# EAGLE design Expand_v1_01 (EAGLE 6.5.0)
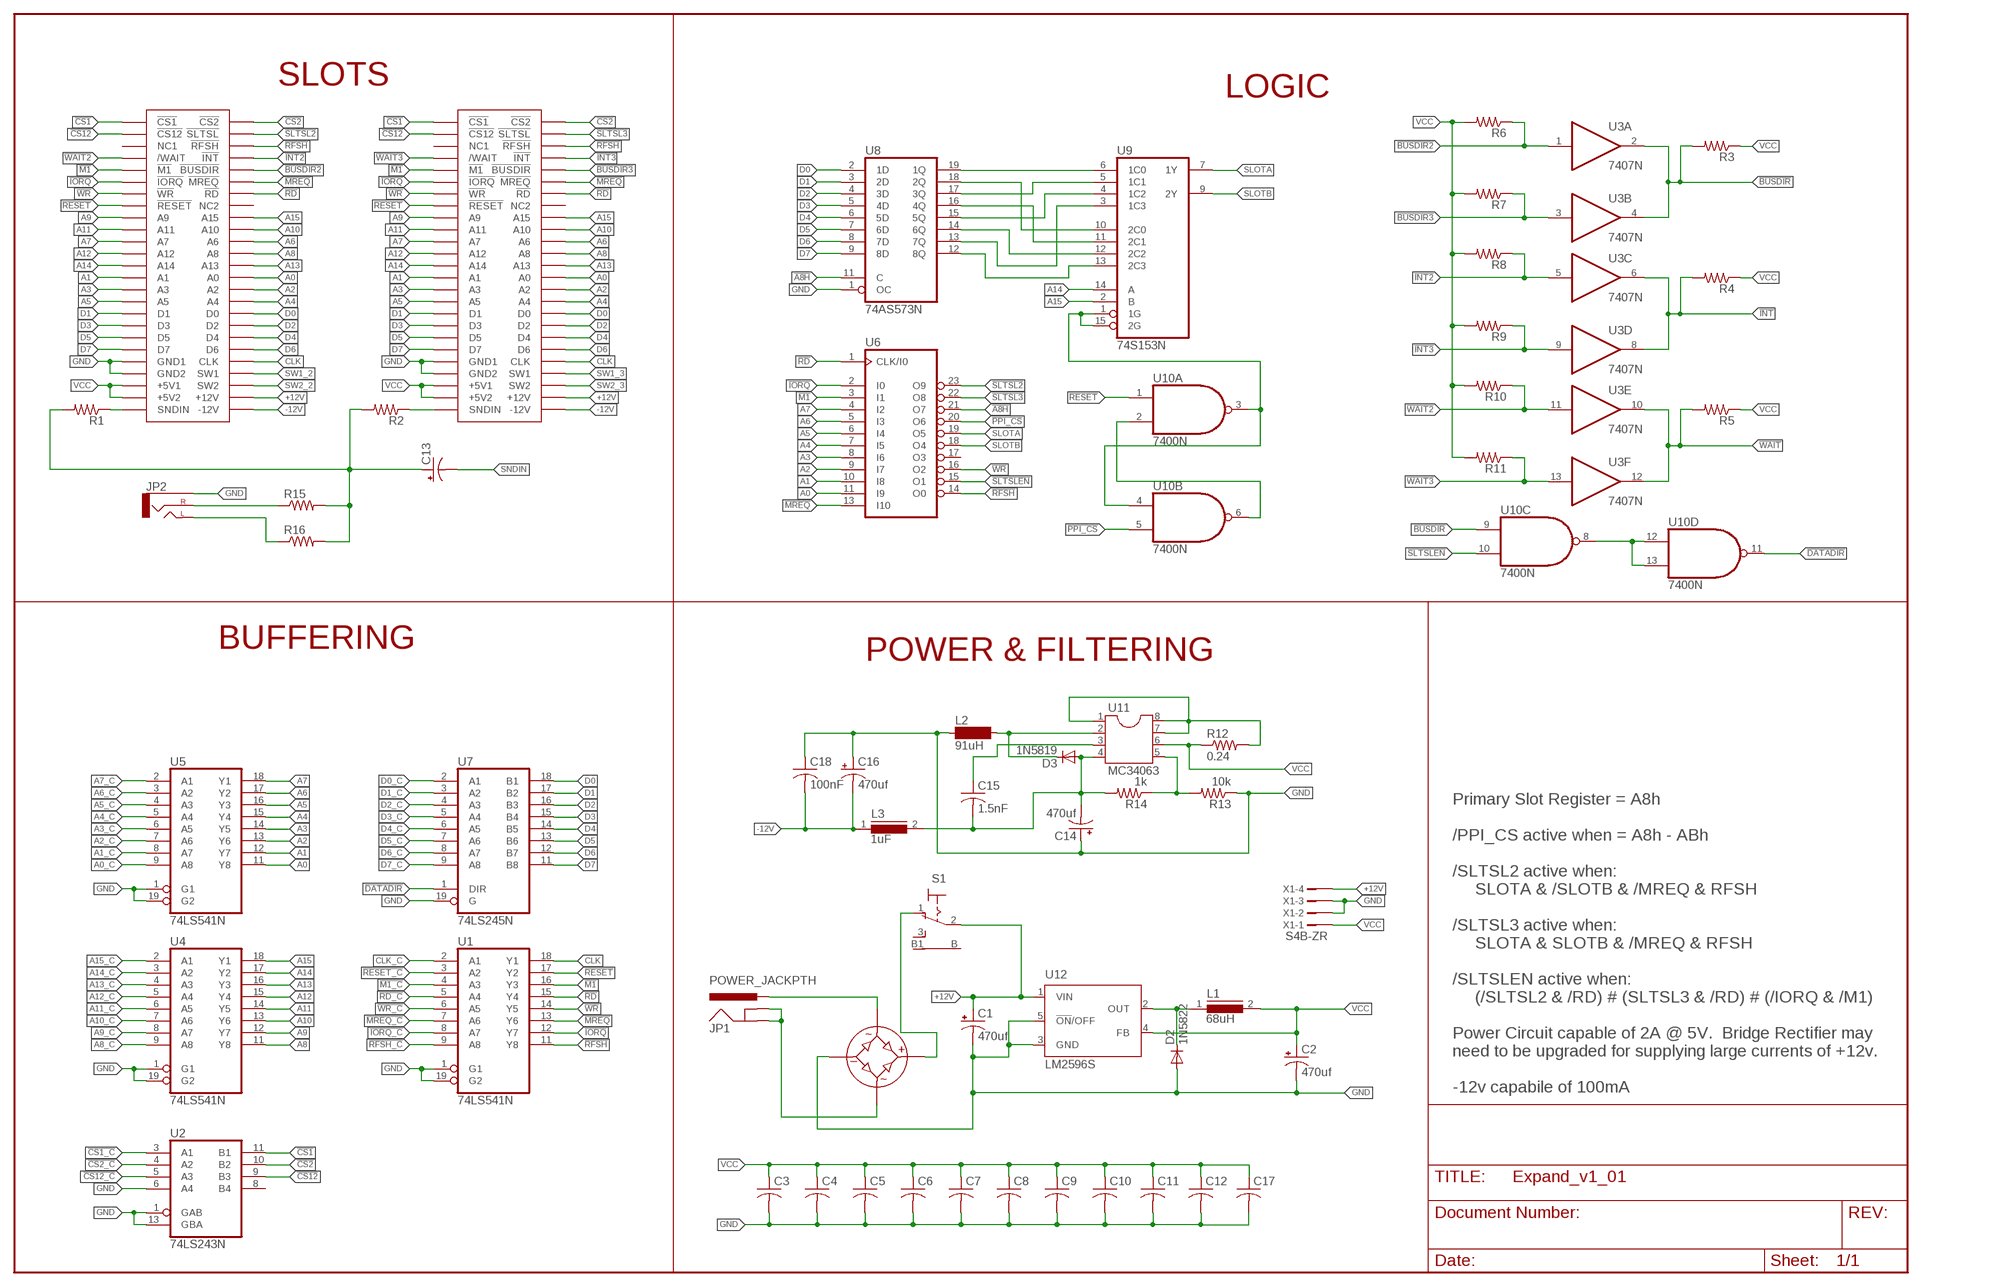
[diagram p0: schematic, sheet 1]

## Parts
C1  470uf  CPOL-USE5-10.5  [E5-10,5]
C2  470uf  CPOL-USE5-10.5  [E5-10,5]
C3  C-US050-030X075  [C050-030X075]
C4  C-US050-030X075  [C050-030X075]
C5  C-US050-030X075  [C050-030X075]
C6  C-US050-030X075  [C050-030X075]
C7  C-US050-030X075  [C050-030X075]
C8  C-US050-030X075  [C050-030X075]
C9  C-US050-030X075  [C050-030X075]
C10  C-US050-030X075  [C050-030X075]
C11  C-US050-030X075  [C050-030X075]
C12  C-US050-030X075  [C050-030X075]
C13  CPOL-USE2-4  [E2-4]
C14  470uf  CPOL-USE5-10.5  [E5-10,5]
C15  1.5nF  C-US050-030X075  [C050-030X075]
C16  470uf  CPOL-USE5-10.5  [E5-10,5]
C17  C-US050-030X075  [C050-030X075]
C18  100nF  C-US050-030X075  [C050-030X075]
D1  2W10  [2W10]
D2  1N5822  1N5624  [DO201-15]
D3  1N5819  DIODE-DO15-12  [DO15-12]
JP1  POWER_JACKPTH  [POWER_JACK_PTH]
JP2  AUDIO-JACK1:1  [STEREOJACK2.5MM]
L1  68uH  A26GFC  [A26GFC]
L2  91uH  BS11  [BS11]
L3  1uF  MCC10  [MCC10]
R1  R-US_0207/7  [0207/7]
R2  R-US_0207/7  [0207/7]
R3  R-US_0207/7  [0207/7]
R4  R-US_0207/7  [0207/7]
R5  R-US_0207/7  [0207/7]
R6  R-US_0207/7  [0207/7]
R7  R-US_0207/7  [0207/7]
R8  R-US_0207/7  [0207/7]
R9  R-US_0207/7  [0207/7]
R10  R-US_0207/7  [0207/7]
R11  R-US_0207/7  [0207/7]
R12  0.24  R-US_0207/7  [0207/7]
R13  10k  R-US_0207/7  [0207/7]
R14  1k  R-US_0207/7  [0207/7]
R15  R-US_0207/7  [0207/7]
R16  R-US_0207/7  [0207/7]
S1  9070-1W  [9070-1W]
U1  74LS541N  [DIL20]
U2  74LS243N  [DIL14]
U3  7407N  [DIL14]
U4  74LS541N  [DIL20]
U5  74LS541N  [DIL20]
U6  22V10  [DIL24-3]
U7  74LS245N  [DIL20]
U8  74AS573N  [DIL20]
U9  74S153N  [DIL16]
U10  7400N  [DIL14]
U11  MC34063  DIL8  [DIL08]
U12  LM2596S  [TO263-5]
U$1  MSX_CART_SLOT  [CART_SLOT]
U$2  MSX_CART_SLOT  [CART_SLOT]
X1  S4B-ZR  [S4B-ZR]

## Nets
!A8H: U6.21(O7) U8.11(C)
!BUSDIR: R3.2 U3.2(A:O) U3.4(B:O) U10.9(C:I0)
!BUSDIR2: R6.1 U3.1(A:I) U$1.P$10(!BUSDIR)
!BUSDIR3: R7.1 U3.3(B:I) U$2.P$10(!BUSDIR)
!CS1: U2.11(B1) U$1.P$1(!CS1) U$2.P$1(!CS1)
!CS1_C: U2.3(A1)
!CS2: U2.10(B2) U$1.P$2(!CS2) U$2.P$2(!CS2)
!CS2_C: U2.4(A2)
!CS12: U2.9(B3) U$1.P$3(!CS12) U$2.P$3(!CS12)
!CS12_C: U2.5(A3)
!DATADIR: U7.1(DIR) U10.11(D:O)
!INT: R4.2 U3.6(C:O) U3.8(D:O)
!INT2: R8.1 U3.5(C:I) U$1.P$8(!INT)
!INT3: R9.1 U3.9(D:I) U$2.P$8(!INT)
!IORQ: U1.12(Y7) U6.2(I0) U$1.P$11(!IORQ) U$2.P$11(!IORQ)
!IORQ_C: U1.8(A7)
!M1: U1.16(Y3) U6.3(I1) U$1.P$9(!M1) U$2.P$9(!M1)
!M1_C: U1.4(A3)
!MREQ: U1.13(Y6) U6.13(I10) U$1.P$12(!MREQ) U$2.P$12(!MREQ)
!MREQ_C: U1.7(A6)
!PPI_CS: U6.20(O6) U10.5(B:I1)
!RD: U1.15(Y4) U6.1(CLK/I0) U$1.P$14(!RD) U$2.P$14(!RD)
!RD_C: U1.5(A4)
!RESET: U1.17(Y2) U10.1(A:I0) U$1.P$15(!RESET) U$2.P$15(!RESET)
!RESET_C: U1.3(A2)
!RFSH: U1.11(Y8) U6.14(O0) U$1.P$6(!RFSH) U$2.P$6(!RFSH)
!RFSH_C: U1.9(A8)
!SLTSL2: U6.23(O9) U$1.P$4(!SLTSL)
!SLTSL3: U6.22(O8) U$2.P$4(!SLTSL)
!SLTSLEN: U6.15(O1) U10.10(C:I1)
!WAIT: R5.2 U3.10(E:O) U3.12(F:O)
!WAIT2: R10.1 U3.11(E:I) U$1.P$7(/WAIT)
!WAIT3: R11.1 U3.13(F:I) U$2.P$7(/WAIT)
!WR: U1.14(Y5) U6.16(O2) U$1.P$13(!WR) U$2.P$13(!WR)
!WR_C: U1.6(A5)
+12V: C1.+ S1.2(P) U12.1(VIN) U$1.P$48(+12V) U$2.P$48(+12V) X1.4
-12V: C16.- C18.2 L3.1 U$1.P$50(-12V) U$2.P$50(-12V)
A0: U5.11(Y8) U6.11(I9) U$1.P$28(A0) U$2.P$28(A0)
A0_C: U5.9(A8)
A1: U5.12(Y7) U6.10(I8) U$1.P$27(A1) U$2.P$27(A1)
A1_C: U5.8(A7)
A2: U5.13(Y6) U6.9(I7) U$1.P$30(A2) U$2.P$30(A2)
A2_C: U5.7(A6)
A3: U5.14(Y5) U6.8(I6) U$1.P$29(A3) U$2.P$29(A3)
A3_C: U5.6(A5)
A4: U5.15(Y4) U6.7(I5) U$1.P$32(A4) U$2.P$32(A4)
A4_C: U5.5(A4)
A5: U5.16(Y3) U6.6(I4) U$1.P$31(A5) U$2.P$31(A5)
A5_C: U5.4(A3)
A6: U5.17(Y2) U6.5(I3) U$1.P$22(A6) U$2.P$22(A6)
A6_C: U5.3(A2)
A7: U5.18(Y1) U6.4(I2) U$1.P$21(A7) U$2.P$21(A7)
A7_C: U5.2(A1)
A8: U4.11(Y8) U$1.P$24(A8) U$2.P$24(A8)
A8_C: U4.9(A8)
A9: U4.12(Y7) U$1.P$17(A9) U$2.P$17(A9)
A9_C: U4.8(A7)
A10: U4.13(Y6) U$1.P$20(A10) U$2.P$20(A10)
A10_C: U4.7(A6)
A11: U4.14(Y5) U$1.P$19(A11) U$2.P$19(A11)
A11_C: U4.6(A5)
A12: U4.15(Y4) U$1.P$23(A12) U$2.P$23(A12)
A12_C: U4.5(A4)
A13: U4.16(Y3) U$1.P$26(A13) U$2.P$26(A13)
A13_C: U4.4(A3)
A14: U4.17(Y2) U9.14(A) U$1.P$25(A14) U$2.P$25(A14)
A14_C: U4.3(A2)
A15: U4.18(Y1) U9.2(B) U$1.P$18(A15) U$2.P$18(A15)
A15_C: U4.2(A1)
CLK: U1.18(Y1) U$1.P$42(CLK) U$2.P$42(CLK)
CLK_C: U1.2(A1)
D0: U7.18(B1) U8.2(1D) U$1.P$34(D0) U$2.P$34(D0)
D0_C: U7.2(A1)
D1: U7.17(B2) U8.3(2D) U$1.P$33(D1) U$2.P$33(D1)
D1_C: U7.3(A2)
D2: U7.16(B3) U8.4(3D) U$1.P$36(D2) U$2.P$36(D2)
D2_C: U7.4(A3)
D3: U7.15(B4) U8.5(4D) U$1.P$35(D3) U$2.P$35(D3)
D3_C: U7.5(A4)
D4: U7.14(B5) U8.6(5D) U$1.P$38(D4) U$2.P$38(D4)
D4_C: U7.6(A5)
D5: U7.13(B6) U8.7(6D) U$1.P$37(D5) U$2.P$37(D5)
D5_C: U7.7(A6)
D6: U7.12(B7) U8.8(7D) U$1.P$40(D6) U$2.P$40(D6)
D6_C: U7.8(A7)
D7: U7.11(B8) U8.9(8D) U$1.P$39(D7) U$2.P$39(D7)
D7_C: U7.9(A8)
GND: C1.- C2.- C3.2 C4.2 C5.2 C6.2 C7.2 C8.2 C9.2 C10.2 C11.2 C12.2 C14.+ C16.+ C17.2 C18.1 D1.P$4 D2.A JP2.5(SLEEVE) L2.1 R13.1 U1.1(G1) U1.19(G2) U2.1(GAB) U2.6(A4) U2.13(GBA) U4.1(G1) U4.19(G2) U5.1(G1) U5.19(G2) U7.19(G) U8.1(OC) U12.3(GND) U12.5(!ON!/OFF) U$1.P$41(GND1) U$1.P$43(GND2) U$2.P$41(GND1) U$2.P$43(GND2) X1.2 X1.3
N$1: R2.1 U$2.P$49(SNDIN)
N$2: R1.1 U$1.P$49(SNDIN)
N$3: U8.19(1Q) U9.6(1C0)
N$4: C13.+ R1.2 R2.2 R15.2 R16.2
N$5: U8.18(2Q) U9.10(2C0)
N$6: U8.17(3Q) U9.5(1C1)
N$7: U8.16(4Q) U9.11(2C1)
N$8: U8.15(5Q) U9.4(1C2)
N$9: U8.14(6Q) U9.12(2C2)
N$10: U8.13(7Q) U9.3(1C3)
N$11: U8.12(8Q) U9.13(2C3)
N$12: U10.2(A:I1) U10.6(B:O)
N$13: U9.1(1G) U9.15(2G) U10.3(A:O) U10.4(B:I0)
N$14: U10.8(C:O) U10.12(D:I0) U10.13(D:I1)
N$18: D1.P$2 S1.1(O)
N$20: R12.2 U11.1 U11.7 U11.8
N$21: JP2.4(RIGHT) R15.1
N$22: R13.2 R14.1 U11.5
N$23: D1.P$1 JP1.PWR
N$24: D1.P$3 JP1.GND JP1.GNDBREAK
N$25: C14.- C15.2 D3.A L3.2 R14.2 U11.4
N$26: C15.1 U11.3
N$27: D3.C L2.2 U11.2
N$28: JP2.1(LEFT) R16.1
N$29: D2.C L1.1 U12.2(OUT)
SLOTA: U6.19(O5) U9.7(1Y)
SLOTB: U6.18(O4) U9.9(2Y)
SNDIN: C13.-
SW1_2: U$1.P$44(SW1)
SW1_3: U$2.P$44(SW1)
SW2_2: U$1.P$46(SW2)
SW2_3: U$2.P$46(SW2)
VCC: C2.+ C3.1 C4.1 C5.1 C6.1 C7.1 C8.1 C9.1 C10.1 C11.1 C12.1 C17.1 L1.2 R3.1 R4.1 R5.1 R6.2 R7.2 R8.2 R9.2 R10.2 R11.2 R12.1 U11.6 U12.4(FB) U$1.P$45(+5V1) U$1.P$47(+5V2) U$2.P$45(+5V1) U$2.P$47(+5V2) X1.1
Unconnected: S1.3(S) S1.B S1.B1 U2.8(B4) U6.17(O3) U$1.P$5(NC1) U$1.P$16(NC2) U$2.P$5(NC1) U$2.P$16(NC2)

## Notes on the sheet
- SLOTS
- LOGIC
- BUFFERING
- POWER & FILTERING
- Primary Slot Register = A8h
  
  /PPI_CS active when = A8h - ABh
  
  /SLTSL2 active when:
       SLOTA & /SLOTB & /MREQ & RFSH
  
  /SLTSL3 active when:
       SLOTA & SLOTB & /MREQ & RFSH
  
  /SLTSLEN active when:
       (/SLTSL2 & /RD) # (SLTSL3 & /RD) # (/IORQ & /M1)
  
  Power Circuit capable of 2A @ 5V.  Bridge Rectifier may
  need to be upgraded for supplying large currents of +12v.
  
  -12v capabile of 100mA

## Power pins joined to a net without a drawn wire
GND: U1.10(GND) U2.7(GND) U3.7(P:GND) U4.10(GND) U5.10(GND) U6.12(GND) U7.10(GND) U8.10(GND) U9.8(GND) U10.7(P:GND)
VCC: U1.20(VCC) U2.14(VCC) U3.14(P:VCC) U4.20(VCC) U5.20(VCC) U6.24(VCC) U7.20(VCC) U8.20(VCC) U9.16(VCC) U10.14(P:VCC)

## Library data of the parts
C1 C2 C13 C14 C16 = rcl:CPOL-US: POLARIZED CAPACITOR, American symbol
C3-C12 C15 C17 C18 = rcl:C-US: CAPACITOR, American symbol
D1 = My_Parts:2W10
D2 = diode:1N5624: DIODE controlled avalanche rectifier
D3 = diode:DIODE-: DIODE
JP1 = SparkFun-Connectors:POWER_JACK: Power Jack This is the standard 5.5mm barrel jack for power. The PTH is the most common, proven, reliable, footprint. The Slot footprint only works if the mill layer is transmitted to the PCB fab house so be warned. Mating wall wart : TOL-00298 (and others); PROD_ID: CONN-08197
JP2 = SparkFun-Connectors:AUDIO-JACK: 3.5mm Audio Jack Simple 3.5mm common PCB mount audio jack. Variant PTH is our storefront SKU PRT-08032
L1 = inductors:A26GFC: INDUCTOR
L2 = inductor-neosid:BS: INDUCTOR nominal inductance, magnetically screened; OC_FARNELL: unknown; OC_NEWARK: unknown
L3 = inductors:MCC10: INDUCTOR
R1-R16 = rcl:R-US_: RESISTOR, American symbol
S1 = switch:9070-1W: TOGGLE SWITCH Marquardt
U1 U4 U5 = 74xx-us:74*541: Octal BUFFER and LINE DRIVER, 3-state
U2 = 74xx-us:74*243: Quadruple BUS TRANSCEIVER
U3 = 74xx-us:74*07: Hex BUFFER, open collector high-voltage output
U6 = pal:22V10: PAL; MPN: GAL22V10D-7LPN; OC_FARNELL: 1571925; OC_NEWARK: 97M0480
U7 = 74xx-us:74*245: Octal BUS TRANSCEIVER, 3-state
U8 = 74xx-us:74*573: 8-bit D latch BUS DRIVER
U9 = 74xx-us:74*153: Dual 4-line to 1-line data SELECTOR/MULTIPLEXER
U10 = 74xx-us:74*00: Quad 2-input NAND gate
U11 = ic-package:DIL8: Dual In Line / Socket
U12 = national-semiconductor:LM2596: SIMPLE SWITCHER® Power Converter 150 kHz 3A Step-Down Voltage Regulator Source: http://www.national.com/ds/LM/LM2596.pdf; MF: NATIONAL SEMICONDUCTOR; MPN: LM2596S-ADJ/NOPB; OC_FARNELL: 9494367; OC_NEWARK: 41K3842
U$1 U$2 = msx-con:MSX_CART_SLOT
X1 = con-jst:?4B-ZR: ZH CONNECTOR 1.5 mm, 4 pin 1 row Source: http://www.jst.com .. eZH.pdf; MF: FARNELL; MPN: S4B-ZR(LF)(SN); OC_FARNELL: 9491830; OC_NEWARK: 38K8076

## Board
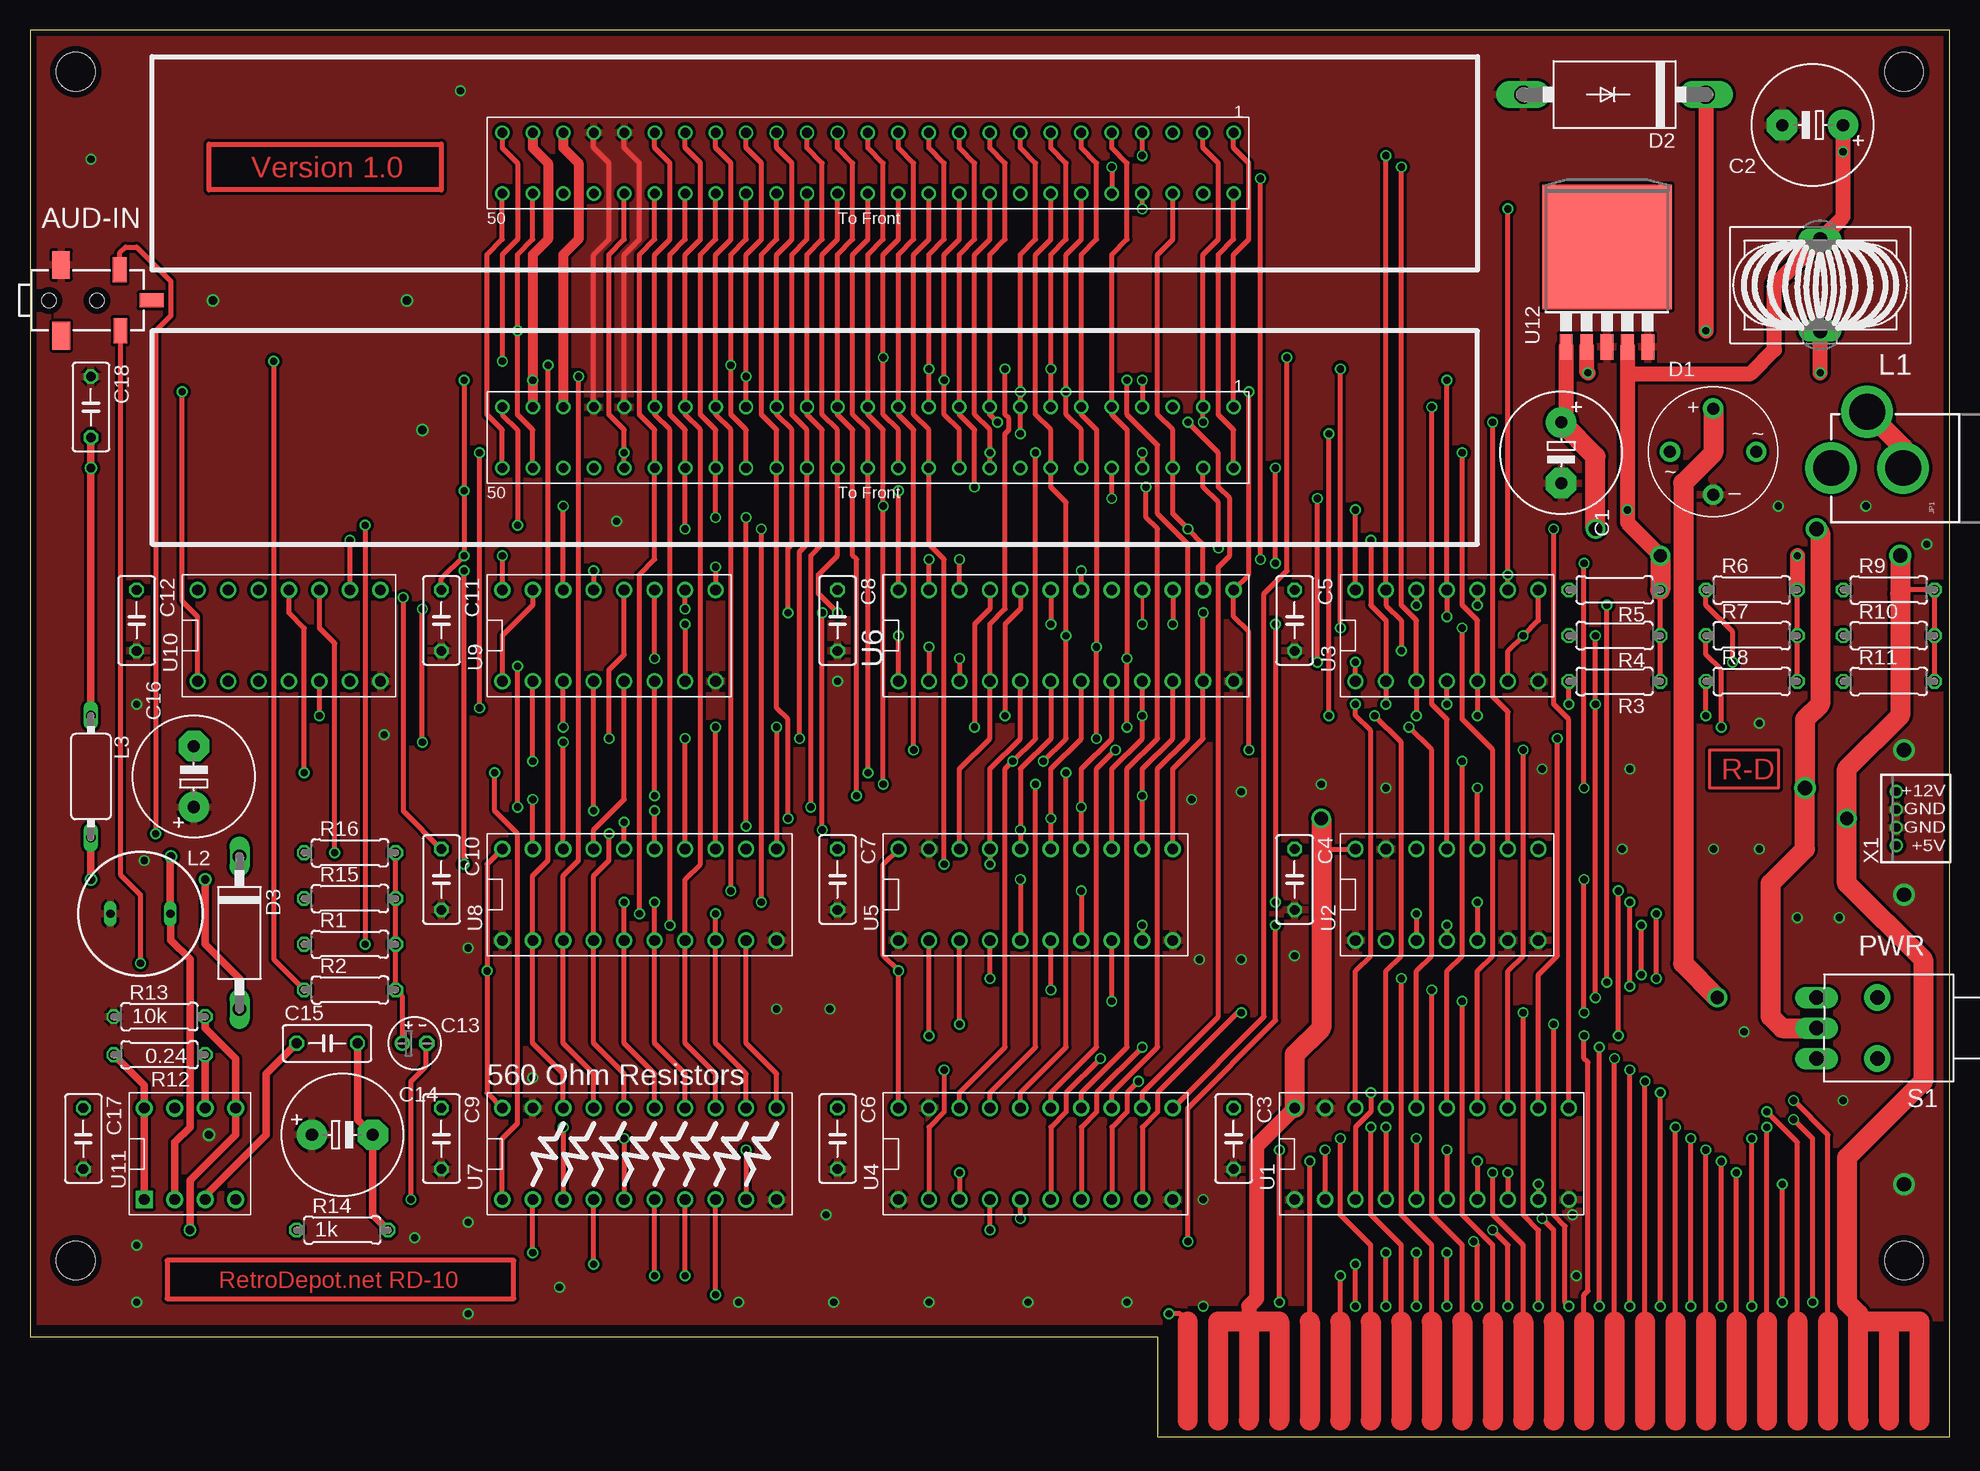
[diagram p1: board, top side]
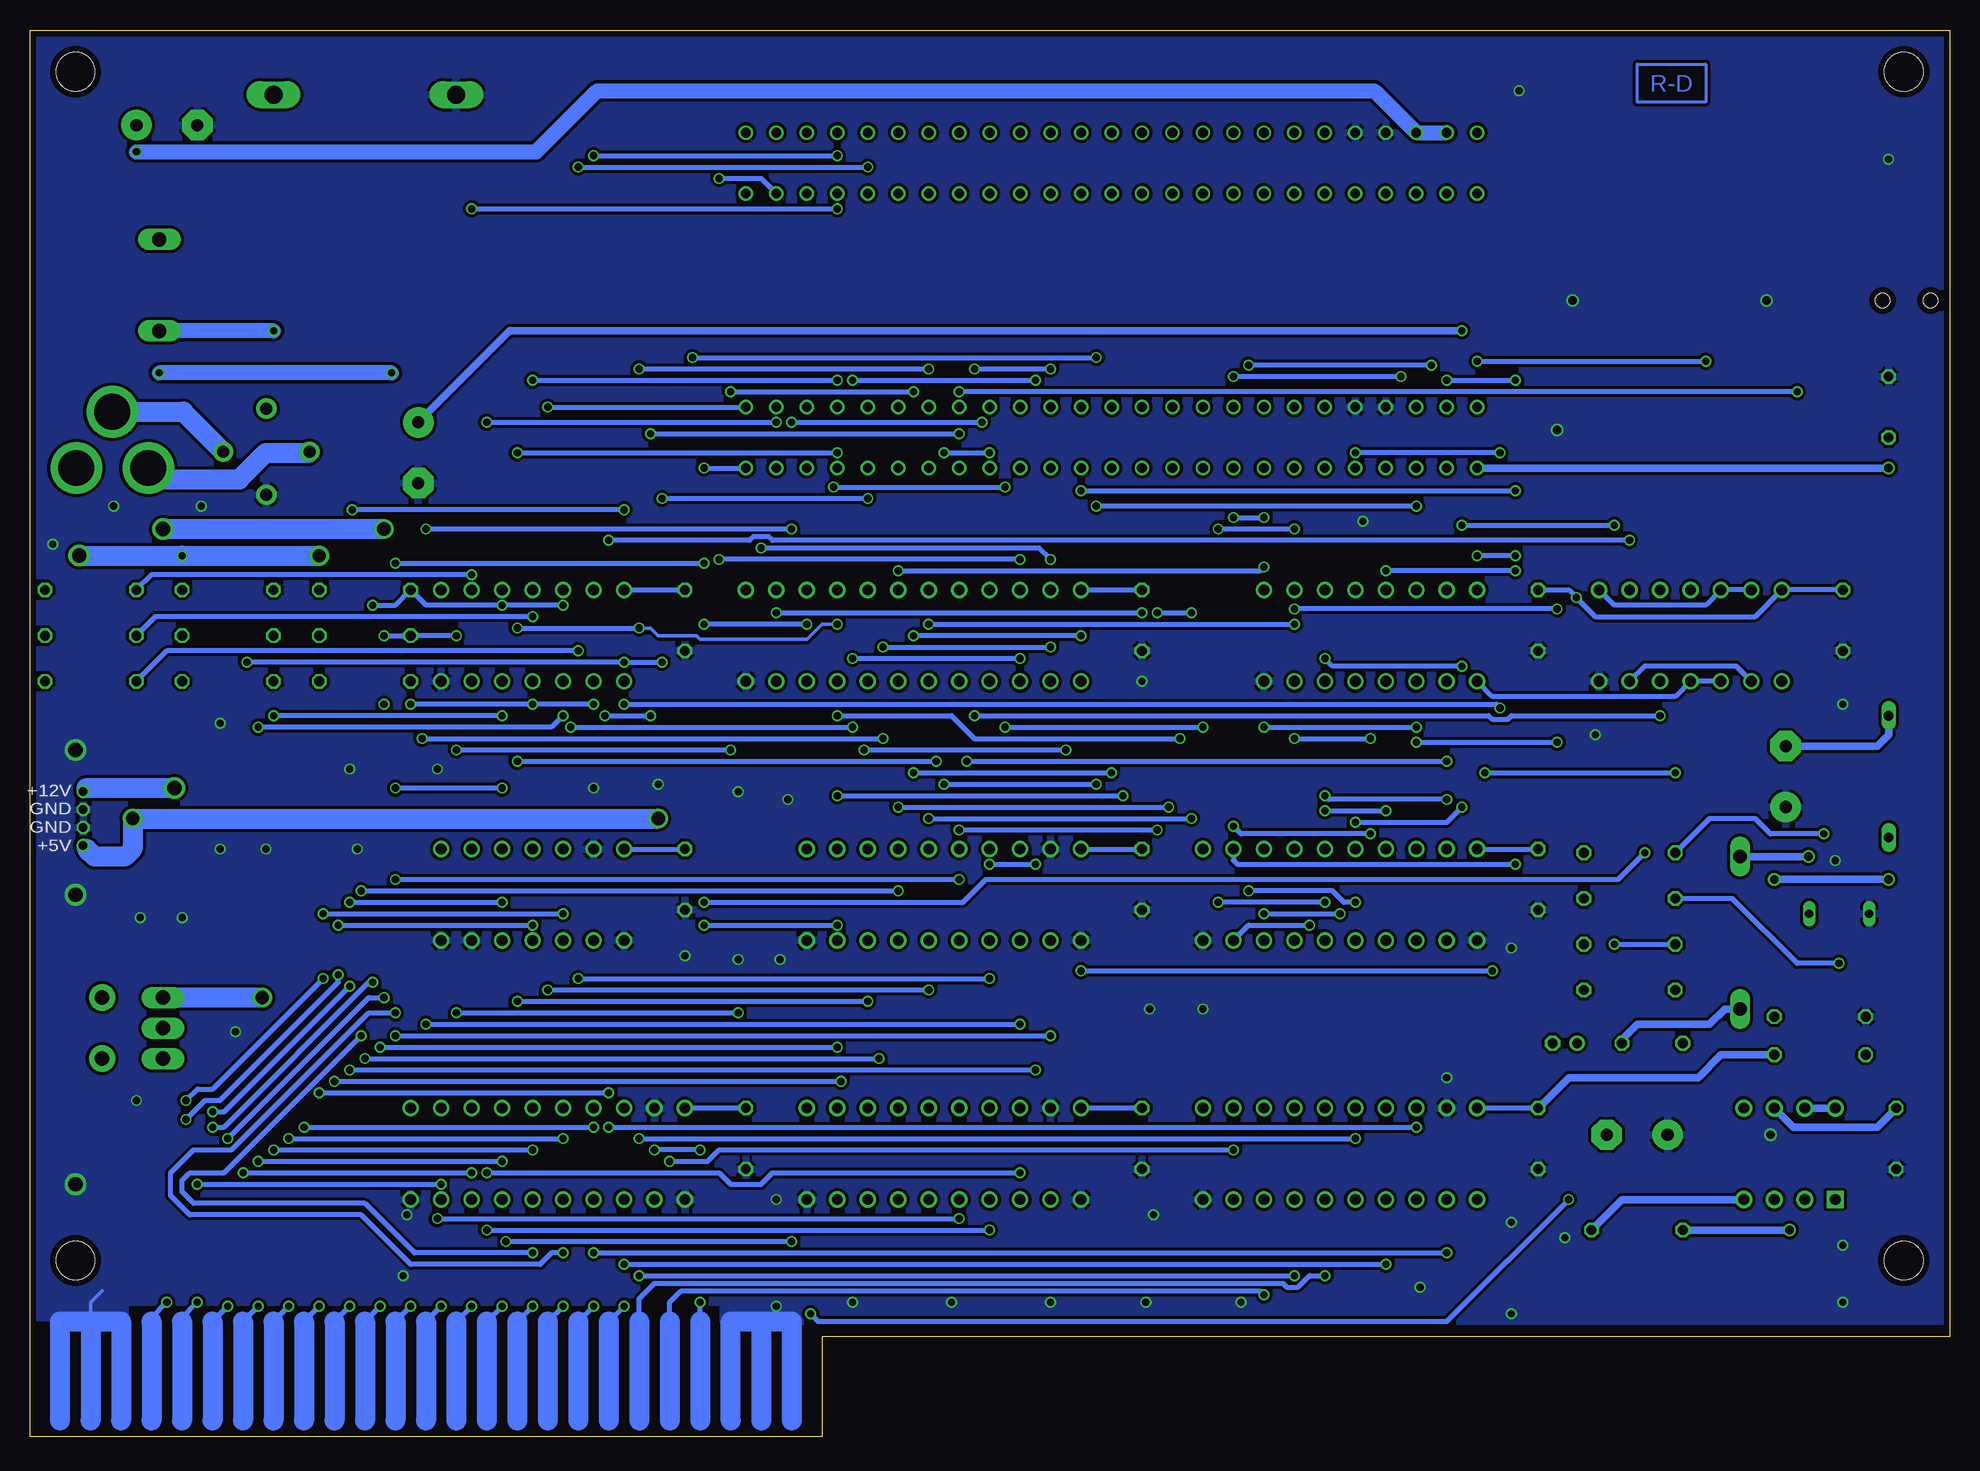
[diagram p2: board, bottom side, seen from below]

Size 160 x 117.24 mm. Coordinates in mm from the lower left corner, seen from the top.
Outline: 0,8.36 93.98,8.36 93.98,0 160,0 160,117.24 0,117.24 0,8.36
Copper layers (1*16): Top 0.035mm / dielectric 1.6mm / Bottom 0.035mm
Design rules "JLCPCB-2-layer-rule": minimum track width 5mil, minimum drill 0.2mm, track to track 5mil, track to pad 5mil, pad to pad 5mil, via to via 5mil, smd to smd 0mil, copper to edge 20mil, drill to drill 0.00508125mm, minimum pad ring 6mil, minimum via ring 6mil, stop-mask expansion 0mil, vias tented up to drill 0.002540625mm, thermal gap 10mil
Holes 3.2 mm at 156.21,113.77 3.81,113.77 3.81,14.7 156.21,14.7

### Footprints (pad centres in the part's own frame; a part is rotated, then mirrored left to right if it is on the bottom)
E5-10,5 = drill 1.016 pad 2.54: + -2.54,0 | drill 1.016 pad 2.54 octagon: - 2.54,0
C050-030X075 = drill 0.813 octagon: 1 -2.54,0; 2 2.54,0
E2-4 = drill 0.813 pad 1.27: + -1.016,0 | drill 0.813 pad 1.27 octagon: - 1.016,0
2W10 = drill 1 pad 1.676: P$1 -3.631,0.093; P$2 -0.039,3.685; P$3 3.554,0.093; P$4 -0.039,-3.499
DO201-15 = drill 1.499 long: A 7.62,0; C -7.62,0
DO15-12 = drill 1.118 long: A 6.35,0; C -6.35,0
POWER_JACK_PTH = drill 2.997 pad 4.318: GND 0,7.7; GNDBREAK 4.7,10.7; PWR 0,13.7
STEREOJACK2.5MM = smd 1.144 x 2.1: 1 5.898,2.54 | smd 1.998 x 1.17: 3 8.55,0 | smd 1.119 x 2.1: 4 5.949,-2.54 | smd 1.467 x 2.3: 5 1,2.952; A 1.016,-2.952 | hole 1.2: 0,0; 4,0
A26GFC = drill 1.194 long: 1 0,3.81; 2 0,-3.81
BS11 = drill 0.7 long: 1 -2.5,0; 2 2.5,0
MCC10 = drill 0.813 long: 1 -5.08,0; 2 5.08,0
0207/7 = drill 0.813 octagon: 1 -3.81,0; 2 3.81,0
9070-1W = drill 1.2 long: 1 5.08,-2.54; 2 5.08,0; 3 5.08,2.54 | drill 1.2 pad 2.184: B 0,-2.54; B1 0,2.54
DIL20 = drill 0.9: 1 -11.43,-3.81; 2 -8.89,-3.81; 3 -6.35,-3.81; 4 -3.81,-3.81; 5 -1.27,-3.81; 6 1.27,-3.81; 7 3.81,-3.81; 8 6.35,-3.81; 9 8.89,-3.81; 10 11.43,-3.81; 11 11.43,3.81; 12 8.89,3.81; 13 6.35,3.81; 14 3.81,3.81; 15 1.27,3.81; 16 -1.27,3.81; 17 -3.81,3.81; 18 -6.35,3.81; 19 -8.89,3.81; 20 -11.43,3.81
DIL14 = drill 0.9: 1 -7.62,-3.81; 2 -5.08,-3.81; 3 -2.54,-3.81; 4 0,-3.81; 5 2.54,-3.81; 6 5.08,-3.81; 7 7.62,-3.81; 8 7.62,3.81; 9 5.08,3.81; 10 2.54,3.81; 11 0,3.81; 12 -2.54,3.81; 13 -5.08,3.81; 14 -7.62,3.81
DIL24-3 = drill 0.9: 1 -13.97,-3.81; 2 -11.43,-3.81; 3 -8.89,-3.81; 4 -6.35,-3.81; 5 -3.81,-3.81; 6 -1.27,-3.81; 7 1.27,-3.81; 8 3.81,-3.81; 9 6.35,-3.81; 10 8.89,-3.81; 11 11.43,-3.81; 12 13.97,-3.81; 13 13.97,3.81; 14 11.43,3.81; 15 8.89,3.81; 16 6.35,3.81; 17 3.81,3.81; 18 1.27,3.81; 19 -1.27,3.81; 20 -3.81,3.81; 21 -6.35,3.81; 22 -8.89,3.81; 23 -11.43,3.81; 24 -13.97,3.81
DIL16 = drill 0.9: 1 -8.89,-3.81; 2 -6.35,-3.81; 3 -3.81,-3.81; 4 -1.27,-3.81; 5 1.27,-3.81; 6 3.81,-3.81; 7 6.35,-3.81; 8 8.89,-3.81; 9 8.89,3.81; 10 6.35,3.81; 11 3.81,3.81; 12 1.27,3.81; 13 -1.27,3.81; 14 -3.81,3.81; 15 -6.35,3.81; 16 -8.89,3.81
DIL08 = drill 0.9 pad 1.422 square: 1 -3.81,-3.81 | drill 0.9 pad 1.422: 2 -1.27,-3.81; 3 1.27,-3.81; 4 3.81,-3.81; 5 3.81,3.81; 6 1.27,3.81; 7 -1.27,3.81; 8 -3.81,3.81
TO263-5 = smd 1.067 x 2.159: 1 -3.404,-5.791; 2 -1.702,-5.791; 3 0,-5.791; 4 1.702,-5.791; 5 3.404,-5.791 | smd 10.8 x 10.41: 6 0,2.54
CART_SLOT = drill 0.8: P$1 30.48,2.54; P$2 30.48,-2.54; P$3 27.94,2.54; P$4 27.94,-2.54; P$5 25.4,2.54; P$6 25.4,-2.54; P$7 22.86,2.54; P$8 22.86,-2.54; P$9 20.32,2.54; P$10 20.32,-2.54; P$11 17.78,2.54; P$12 17.78,-2.54; P$13 15.24,2.54; P$14 15.24,-2.54; P$15 12.7,2.54; P$16 12.7,-2.54; P$17 10.16,2.54; P$18 10.16,-2.54; P$19 7.62,2.54; P$20 7.62,-2.54; P$21 5.08,2.54; P$22 5.08,-2.54; P$23 2.54,2.54; P$24 2.54,-2.54; P$25 0,2.54; P$26 0,-2.54; P$27 -2.54,2.54; P$28 -2.54,-2.54; P$29 -5.08,2.54; P$30 -5.08,-2.54; P$31 -7.62,2.54; P$32 -7.62,-2.54; P$33 -10.16,2.54; P$34 -10.16,-2.54; P$35 -12.7,2.54; P$36 -12.7,-2.54; P$37 -15.24,2.54; P$38 -15.24,-2.54; P$39 -17.78,2.54; P$40 -17.78,-2.54; P$41 -20.32,2.54; P$42 -20.32,-2.54; P$43 -22.86,2.54; P$44 -22.86,-2.54; P$45 -25.4,2.54; P$46 -25.4,-2.54; P$47 -27.94,2.54; P$48 -27.94,-2.54; P$49 -30.48,2.54; P$50 -30.48,-2.54
S4B-ZR = drill 0.7 pad 1.1: 1 -2.25,0; 2 -0.75,0; 3 0.75,0; 4 2.25,0

### Placement (x,y rotation side)
C1  127.64,82.02 270 top
C2  148.59,109.32 180 top
C3  100.33,24.86 270 top
C4  105.41,46.46 270 top
C5  105.41,68.05 270 top
C6  67.31,24.86 270 top
C7  67.31,46.46 270 top
C8  67.31,68.05 270 top
C9  34.29,24.86 270 top
C10  34.29,46.46 270 top
C11  34.29,68.05 270 top
C12  8.89,68.05 270 top
C13  32.07,32.8 0 top
C14  26.04,25.18 0 top
C15  24.77,32.8 0 top
C16  13.65,55.03 90 top
C17  4.45,24.86 270 top
C18  5.08,85.82 270 top
D1  140.34,82.02 0 top
D2  132.08,111.86 180 top
D3  17.46,42.01 270 top
JP1  163.83,80.74 90 top
JP2  1.59,94.71 0 top
L1  149.22,95.98 180 top
L2  9.21,43.6 0 top
L3  5.08,55.03 270 top
R1  26.67,41.06 0 top
R2  26.67,37.25 0 top
R3  132.08,62.97 180 top
R4  132.08,66.77 180 top
R5  132.08,70.58 180 top
R6  143.51,70.58 0 top
R7  143.51,66.77 0 top
R8  143.51,62.97 0 top
R9  154.94,70.58 0 top
R10  154.94,66.77 0 top
R11  154.94,62.97 0 top
R12  10.79,31.85 180 top
R13  10.79,35.03 0 top
R14  26.04,17.25 0 top
R15  26.67,44.87 0 top
R16  26.67,48.68 0 top
S1  153.99,34.07 180 top
U1  116.84,23.59 0 top
U2  118.11,45.19 0 top
U3  118.11,66.77 0 top
U4  83.82,23.59 0 top
U5  83.82,45.19 0 top
U6  86.36,66.77 0 top
U7  50.8,23.59 0 top
U8  50.8,45.19 0 top
U9  48.26,66.77 0 top
U10  21.59,66.77 0 top
U11  13.34,23.59 0 top
U12  131.44,96.62 0 top
U$1  69.85,83.28 0 top
U$2  69.85,106.14 0 top
X1  155.57,51.54 90 top

### Tracks (layer width: path | path; a pad name or v marks a point on that pad's centre or on a via)
!A8H  (via drill 0.6)
  Top 0.406: U6.21 80.01,69 78.74,67.73 v78.74,59.16 | v62.23,59.16 U8.11
  Bottom 0.406: v78.74,59.16 v62.23,59.16
!BUSDIR  (via drill 0.6)
  Top 0.406: U10.9 v26.67,74.71 | v111.76,74.71 111.76,69.31 113.03,68.05 U3.2 v113.03,61.06 | v128.27,61.06 R3.2 | v118.11,61.06 U3.4
  Bottom 0.406: v113.03,61.06 v118.11,61.06 v128.27,61.06 | v26.67,74.71 98.11,74.71 98.42,75.03 99.69,75.03 100.01,74.71 v111.76,74.71
!BUSDIR2  (via drill 0.6)
  Top 0.406: U3.1 v110.49,64.55 | R6.1 139.7,69.31 141.92,67.09 v141.92,64.55 | v107.31,64.55 v107.31,78.2 | v90.17,78.2 U$1.P$10
  Bottom 0.406: v141.92,64.55 v110.49,64.55 v107.31,64.55 | v107.31,78.2 v90.17,78.2
!BUSDIR3  (via drill 0.6)
  Top 0.406: v114.3,105.83 114.3,69.31 115.57,68.05 U3.3 v115.57,60.11 | v90.17,105.83 U$2.P$10 | v140.97,59.16 140.97,63.92 139.7,65.19 R7.1
  Bottom 0.406: v114.3,105.83 v90.17,105.83 | v115.57,60.11 116.52,59.16 v140.97,59.16
!CS1  (via drill 0.6)
  Top 0.406: U$1.P$1 100.33,98.52 101.6,99.8 101.6,106.14 100.33,107.41 U$2.P$1 | U2.11 118.11,59.79 116.84,61.06 v116.84,85.82
  Bottom 0.406: v116.84,85.82 U$1.P$1
!CS1_C  (via drill 0.6)
  Top 0.406: v115.57,43.6 U2.3 | 149.86,9.62 149.86,25.18 v147,28.04 | v135.57,38.2 v135.57,43.6
  Top 1.676: 149.86,9.62 149.86,1.37
  Bottom 0.406: v135.57,43.6 v115.57,43.6 | v147,28.04 146.05,28.99 144.78,28.99 v135.57,38.2
!CS2  (via drill 0.6)
  Top 0.406: U$2.P$2 100.33,99.8 99.06,98.52 99.06,85.19 100.33,83.92 U$1.P$2 | U2.10 v120.65,54.08 | v129.54,54.08 v129.54,72.81 | v103.82,72.81 v103.82,80.74
  Bottom 0.406: v120.65,54.08 v129.54,54.08 | v129.54,72.81 v103.82,72.81 | v103.82,80.74 U$1.P$2
!CS2_C  (via drill 0.6)
  Top 0.406: v118.11,42.65 U2.4 | v148.59,11.21 148.59,24.86 v147,26.45 | v134.3,38.52 v134.3,42.65
  Bottom 0.406: 149.86,9.62 149.86,9.94 v148.59,11.21 | v134.3,42.65 v118.11,42.65 | v147,26.45 145.41,28.04 144.15,28.04 134.3,37.88 v134.3,38.52
  Bottom 1.676: 149.86,9.62 149.86,1.37
!CS12  (via drill 0.6)
  Top 0.406: U$2.P$3 97.79,107.41 99.06,106.14 99.06,99.8 97.79,98.52 U$1.P$3 v97.79,84.55 | U2.9 123.19,60.43 121.92,61.7 v121.92,84.55
  Bottom 0.406: v121.92,84.55 v97.79,84.55
!CS12_C  (via drill 0.6)
  Top 0.406: v120.65,44.55 U2.5 | 147.32,9.62 147.32,24.55 v144.78,27.09 | v133.35,37.57 v133.35,44.55
  Top 1.676: 147.32,9.62 147.32,1.37
  Bottom 0.406: v133.35,44.55 v120.65,44.55 | v144.78,27.09 143.83,27.09 v133.35,37.57
!DATADIR  (via drill 0.6)
  Top 0.406: U7.1 39.37,24.86 40.64,26.13 40.64,50.27 38.73,52.17 v38.73,55.35 | v22.86,55.35 22.86,67.41 21.59,68.68 U10.11
  Bottom 0.406: v38.73,55.35 v22.86,55.35
!INT  (via drill 0.6)
  Top 0.406: U3.6 123.19,65.5 v124.46,66.77 125.73,68.05 U3.8 | v130.49,66.77 v130.49,61.06 v130.49,36.61 | v143.51,10.89 v143.51,24.86
  Bottom 0.406: v124.46,66.77 R4.2 v130.49,66.77 | 144.78,9.62 v143.51,10.89 | v143.51,24.86 131.76,36.61 v130.49,36.61
  Bottom 1.676: 144.78,9.62 144.78,1.37
!INT2  (via drill 0.6)
  Top 0.406: v119.38,82.02 119.38,69.31 120.65,68.05 U3.5 v120.65,60.11 | v92.71,82.02 U$1.P$8 | v139.7,60.11 R8.1
  Bottom 0.406: v119.38,82.02 v92.71,82.02 | v120.65,60.11 v139.7,60.11
!INT3  (via drill 0.6)
  Top 0.406: U3.9 v123.19,71.85 v123.19,102.33 | v92.71,102.33 U$2.P$8
  Bottom 0.406: v123.19,102.33 v92.71,102.33 | v123.19,71.85 149.86,71.85 R9.1
!IORQ  (via drill 0.6)
  Top 0.406: U$2.P$11 87.63,107.41 88.9,106.14 88.9,99.8 87.63,98.52 U$1.P$11 87.63,85.19 88.9,83.92 v88.9,65.82 v88.9,58.2 | v74.93,65.82 U6.2 | U1.12 125.73,38.52 127.32,40.11 v127.32,58.2
  Bottom 0.406: v88.9,65.82 v74.93,65.82 | v127.32,58.2 v88.9,58.2
!IORQ_C  (via drill 0.6)
  Top 0.406: 142.24,9.62 v142.24,22.01 | v123.19,22.01 U1.8
  Top 1.676: 142.24,9.62 142.24,1.37
  Bottom 0.406: v142.24,22.01 v123.19,22.01
!M1  (via drill 0.6)
  Top 0.406: U$2.P$9 90.17,107.41 91.44,106.14 91.44,99.8 90.17,98.52 U$1.P$9 90.17,85.19 91.44,83.92 v91.44,64.87 v91.44,59.16 | v77.47,64.87 U6.3 | U1.16 115.57,38.84 116.84,40.11 116.84,57.25 v114.94,59.16
  Bottom 0.406: v91.44,64.87 v77.47,64.87 | v114.94,59.16 v91.44,59.16
!M1_C  (via drill 0.6)
  Top 0.406: 137.16,9.62 v137.16,25.82 | v113.03,25.82 U1.4
  Top 1.676: 137.16,9.62 137.16,1.37
  Bottom 0.406: v137.16,25.82 v113.03,25.82
!MREQ  (via drill 0.6)
  Top 0.406: U$2.P$12 87.63,99.8 86.36,98.52 v86.36,87.09 86.36,85.19 87.63,83.92 U$1.P$12 | v101.6,87.09 101.6,71.85 U6.13 100.33,68.36 101.6,67.09 v101.6,57.25 | U1.13 123.19,38.84 124.46,40.11 v124.46,57.25
  Bottom 0.406: v101.6,87.09 v86.36,87.09 | v124.46,57.25 v101.6,57.25
!MREQ_C  (via drill 0.6)
  Top 0.406: v140.97,10.89 v140.97,22.96 | v120.65,22.96 U1.7
  Bottom 0.406: 142.24,9.62 v140.97,10.89 | v140.97,22.96 v120.65,22.96
  Bottom 1.676: 142.24,9.62 142.24,1.37
!PPI_CS  (via drill 0.6)
  Top 0.406: U6.20 82.55,69 81.28,67.73 v81.28,60.11 | v24.13,60.11 U10.5
  Bottom 0.406: v81.28,60.11 38.42,60.11 38.1,59.79 36.83,59.79 36.51,60.11 v24.13,60.11
!RD  (via drill 0.6)
  Top 0.406: U$2.P$14 85.09,99.8 83.82,98.52 83.82,85.19 85.09,83.92 U$1.P$14 85.09,79.16 86.36,77.89 v86.36,66.77 86.36,58.2 v84.45,56.3 | U6.1 v72.39,66.77 | U1.15 118.11,38.84 119.38,40.11 v119.38,56.3
  Bottom 0.406: v72.39,66.77 v86.36,66.77 | v119.38,56.3 v84.45,56.3
!RD_C  (via drill 0.6)
  Top 0.406: v138.43,10.89 v138.43,24.86 | v115.57,24.86 U1.5
  Bottom 0.406: 139.7,9.62 v138.43,10.89 | v138.43,24.86 v115.57,24.86
  Bottom 1.676: 139.7,9.62 139.7,1.37
!RESET  (via drill 0.6)
  Top 0.406: U$2.P$15 82.55,107.41 83.82,106.14 83.82,99.8 82.55,98.52 v82.55,87.09 U$1.P$15 v82.55,83.6 | U10.1 13.97,68.36 12.7,69.63 v12.7,87.09 | U1.17 113.03,38.84 114.3,40.11 114.3,57.89 v112.08,60.11 | v108.27,60.11 v108.27,83.6
  Bottom 0.406: v12.7,87.09 v82.55,87.09 | v112.08,60.11 v108.27,60.11 | v108.27,83.6 v82.55,83.6
!RESET_C  (via drill 0.6)
  Top 0.406: v135.89,10.89 v135.89,28.68 | v111.76,28.68 111.76,27.09 110.49,25.82 U1.3
  Bottom 0.406: 137.16,9.62 v135.89,10.89 | v135.89,28.68 v111.76,28.68
  Bottom 1.676: 137.16,9.62 137.16,1.37
!RFSH  (via drill 0.6)
  Top 0.406: U$2.P$6 95.25,99.8 93.98,98.52 93.98,85.19 95.25,83.92 U$1.P$6 95.25,76.94 v96.52,75.66 97.79,74.39 U6.14 | U1.11 128.27,59.79 127,61.06 v127,75.66
  Bottom 0.406: v127,75.66 v96.52,75.66
!RFSH_C  (via drill 0.6)
  Top 0.406: v146.05,11.21 v146.05,21.05 | v125.73,21.05 U1.9
  Bottom 0.406: 147.32,9.62 147.32,9.94 v146.05,11.21 | v146.05,21.05 v125.73,21.05
  Bottom 1.676: 147.32,9.62 147.32,1.37
!SLTSL2  (via drill 0.6)
  Top 0.406: U6.23 v74.93,73.12 | U$1.P$4 97.79,79.16 99.06,77.89 v99.06,74.08
  Bottom 0.406: v74.93,73.12 75.88,74.08 v99.06,74.08
!SLTSL3  (via drill 0.6)
  Top 0.406: U6.22 v77.47,73.12 | v102.55,73.12 v102.55,104.88
  Bottom 0.406: v77.47,73.12 v102.55,73.12 | v102.55,104.88 99.06,104.88 U$2.P$4
!SLTSLEN  (via drill 0.6)
  Top 0.406: U6.15 v95.25,67.73 | v103.82,67.73 v103.82,44.55 | v25.4,48.68 25.4,66.14 24.13,67.41 U10.10
  Bottom 0.406: v95.25,67.73 v103.82,67.73 | v103.82,44.55 82.23,44.55 80.33,46.46 27.62,46.46 v25.4,48.68
!WAIT  (via drill 0.6)
  Top 0.406: U3.10 v120.65,69.31 | U3.12 v115.57,69.31 | 144.78,9.62 v144.78,25.82 | v131.44,37.88 v131.44,69.31
  Top 1.676: 144.78,9.62 144.78,1.37
  Bottom 0.406: v115.57,69.31 v120.65,69.31 127,69.31 R5.2 129.54,69.31 v131.44,69.31 | v144.78,25.82 143.83,25.82 131.76,37.88 v131.44,37.88
!WAIT2  (via drill 0.6)
  Top 0.406: v118.11,88.05 U3.11 v118.11,68.36 | v92.71,88.05 U$1.P$7
  Bottom 0.406: v118.11,88.05 v92.71,88.05 | v118.11,68.36 149.54,68.36 R10.1
!WAIT3  (via drill 0.6)
  Top 0.406: v113.03,106.78 U3.13 113.03,69.31 114.3,68.05 v114.3,65.5 | v92.71,106.78 U$2.P$7
  Bottom 0.406: v113.03,106.78 v92.71,106.78 | v114.3,65.5 148.59,65.5 R11.1
!WR  (via drill 0.6)
  Top 0.305: v92.71,67.73 U6.16
  Top 0.406: U$1.P$13 v85.09,89 85.09,98.52 86.36,99.8 86.36,106.14 85.09,107.41 U$2.P$13 | U1.14 120.65,38.84 121.92,40.11 121.92,57.25 119.38,59.79 v119.38,67.41 | v109.22,67.41 v109.22,89
  Bottom 0.305: v109.22,67.41 108.27,67.41 107.63,66.77 104.46,66.77 104.14,66.46 95.25,66.46 93.98,67.73 v92.71,67.73
  Bottom 0.406: v119.38,67.41 v109.22,67.41 | v109.22,89 v85.09,89
!WR_C  (via drill 0.6)
  Top 0.406: 139.7,9.62 v139.7,23.91 | v118.11,23.91 U1.6
  Top 1.676: 139.7,9.62 139.7,1.37
  Bottom 0.406: v139.7,23.91 v118.11,23.91
+12V  (via drill 0.6, 1.1, 1.2)
  Top 0.406: U$2.P$48 41.91,99.8 40.64,98.52 v40.64,92.17 40.64,85.19 41.91,83.92 U$1.P$48
  Top 1.27: U12.1 128.04,84.96 C1.+
  Top 1.676: S1.2 146.05,34.07 145.1,35.03 145.1,46.14 147.96,49 v147.96,54.08 147.96,59.79 149.22,61.06 149.22,75.35 v148.91,75.66 | v130.49,75.66 130.49,81.7 C1.+
  Bottom 0.61: C1.+ 120.02,92.17 v40.64,92.17
  Bottom 1.016: 155.28,54.08 X1.4
  Bottom 1.676: v147.96,54.08 155.28,54.08 | v148.91,75.66 v130.49,75.66
-12V  (via drill 0.7)
  Top 0.406: U$2.P$50 39.37,99.8 38.1,98.52 38.1,85.19 39.37,83.92 U$1.P$50
  Top 0.61: L3.1 v5.08,80.74 C18.2
  Bottom 0.61: U$1.P$50 v5.08,80.74 | L3.1 5.08,58.52 6.03,57.57 C16.-
A0  (via drill 0.6)
  Top 0.406: U$2.P$28 67.31,99.8 66.04,98.52 66.04,85.19 67.31,83.92 U$1.P$28 67.31,73.44 65.72,71.85 65.72,70.27 v67.31,68.68 | U5.11 95.25,55.66 97.79,58.2 U6.11 v97.79,68.68
  Bottom 0.406: v97.79,68.68 v67.31,68.68
A0_C  (via drill 0.6)
  Top 0.406: v120.65,10.89 120.65,15.98 v120.33,16.29 | v96.52,16.29 96.52,27.4 103.82,34.71 v103.82,42.65 | v92.71,42.65 U5.9
  Bottom 0.406: 121.92,9.62 v120.65,10.89 | v120.33,16.29 v96.52,16.29 | v103.82,42.65 v92.71,42.65
  Bottom 1.676: 121.92,9.62 121.92,1.37
A1  (via drill 0.6)
  Top 0.406: U$2.P$27 67.31,107.41 68.58,106.14 68.58,99.8 67.31,98.52 U$1.P$27 67.31,85.19 68.58,83.92 68.58,73.44 68.9,73.12 v68.9,53.44 | U5.12 v92.71,53.44 92.71,55.66 95.25,58.2 U6.10
  Bottom 0.406: v92.71,53.44 v68.9,53.44
A1_C  (via drill 0.6)
  Top 0.406: 121.92,9.62 121.92,15.98 119.38,18.52 v119.38,36.3 | v90.17,36.3 U5.8
  Top 1.676: 121.92,9.62 121.92,1.37
  Bottom 0.406: v119.38,36.3 v90.17,36.3
A2  (via drill 0.6)
  Top 0.406: U$2.P$30 64.77,99.8 63.5,98.52 63.5,85.19 64.77,83.92 U$1.P$30 64.77,74.39 64.14,73.76 v64.14,58.2 | U5.13 90.17,55.66 92.71,58.2 v92.71,60.11 U6.9
  Bottom 0.406: v92.71,60.11 83.19,60.11 81.28,58.2 v64.14,58.2
A2_C  (via drill 0.6)
  Top 0.406: v118.11,10.89 v118.11,15.34 | v87.63,45.5 U5.7 | v132.4,33.44 v132.4,45.5
  Bottom 0.406: 119.38,9.62 v118.11,10.89 | v118.11,15.34 127.95,15.34 132.08,19.47 146.37,19.47 147.32,20.42 147.32,21.37 146.69,22.01 143.83,22.01 v132.4,33.44 | v132.4,45.5 v87.63,45.5
  Bottom 1.676: 119.38,9.62 119.38,1.37
A3  (via drill 0.6)
  Top 0.406: U$2.P$29 64.77,107.41 66.04,106.14 66.04,99.8 64.77,98.52 U$1.P$29 64.77,85.19 66.04,83.92 66.04,74.39 65.09,73.44 v65.09,52.49 | U5.14 v87.63,52.49 87.63,55.66 90.17,58.2 U6.8
  Bottom 0.406: v87.63,52.49 v65.09,52.49
A3_C  (via drill 0.6)
  Top 0.406: 119.38,9.62 119.38,15.98 116.84,18.52 v116.84,37.25 | v85.09,37.25 U5.6
  Top 1.676: 119.38,9.62 119.38,1.37
  Bottom 0.406: v116.84,37.25 v85.09,37.25
A4  (via drill 0.6)
  Top 0.406: U$2.P$32 62.23,99.8 60.96,98.52 60.96,85.19 62.23,83.92 U$1.P$32 62.23,60.74 63.18,59.79 v63.18,51.54 | U5.15 v85.09,51.54 85.09,55.66 87.63,58.2 U6.7
  Bottom 0.406: v85.09,51.54 v63.18,51.54
A4_C  (via drill 0.6)
  Top 0.406: v115.57,10.89 v115.57,15.34 | v82.55,46.46 U5.5 | v129.54,35.34 v129.54,46.46
  Bottom 0.406: 116.84,9.62 v115.57,10.89 | v115.57,15.34 116.52,15.34 117.47,14.39 128.27,14.39 132.4,18.52 146.69,18.52 148.27,20.1 148.27,22.01 146.37,23.91 143.19,23.91 131.76,35.34 v129.54,35.34 | v129.54,46.46 v82.55,46.46
  Bottom 1.676: 116.84,9.62 116.84,1.37
A5  (via drill 0.6)
  Top 0.406: U$2.P$31 62.23,107.41 63.5,106.14 63.5,99.8 62.23,98.52 U$1.P$31 62.23,85.19 63.5,83.92 63.5,74.39 63.18,74.08 v63.18,68.68 | U6.6 85.09,58.2 82.55,55.66 v82.55,50.58 U5.16 | v66.04,50.58 v66.04,68.68
  Bottom 0.406: v82.55,50.58 v66.04,50.58 | v66.04,68.68 v63.18,68.68
A5_C  (via drill 0.6)
  Top 0.406: 116.84,9.62 116.84,15.98 114.3,18.52 v114.3,38.2 | v80.01,38.2 U5.4
  Top 1.676: 116.84,9.62 116.84,1.37
  Bottom 0.406: v114.3,38.2 v80.01,38.2
A6  (via drill 0.6)
  Top 0.406: U$2.P$22 74.93,99.8 73.66,98.52 73.66,85.19 74.93,83.92 U$1.P$22 74.93,74.39 76.2,73.12 v76.2,47.73 | U6.5 82.55,58.2 80.01,55.66 U5.17 v80.01,47.73
  Bottom 0.406: v80.01,47.73 v76.2,47.73
A6_C  (via drill 0.6)
  Top 0.406: v127,34.39 127,18.52 127.95,17.56 127.95,11.21 v128.27,10.89 | v77.47,34.39 U5.3
  Bottom 0.406: 129.54,9.62 v128.27,10.89 | v127,34.39 v77.47,34.39
  Bottom 1.676: 129.54,9.62 129.54,1.37
A7  (via drill 0.6)
  Top 0.406: U$1.P$21 v74.93,89 74.93,98.52 76.2,99.8 76.2,106.14 74.93,107.41 U$2.P$21 | U5.18 77.47,55.66 80.01,58.2 U6.4 80.01,67.73 81.28,69 81.28,83.6 81.6,83.92 81.6,84.87 81.28,85.19 v81.28,89
  Bottom 0.406: v81.28,89 v74.93,89
A7_C  (via drill 0.6)
  Top 0.406: v74.93,33.44 U5.2 | 129.54,9.62 129.54,11.85 129.86,12.16 129.86,31.21 129.54,31.53 v129.54,33.44
  Top 1.676: 129.54,9.62 129.54,1.37
  Bottom 0.406: v129.54,33.44 v74.93,33.44
A8  (via drill 0.6)
  Top 0.406: U$2.P$24 72.39,99.8 71.12,98.52 v71.12,89.95 71.12,85.19 72.39,83.92 U$1.P$24 | U4.11 102.87,35.03 102.87,70.27 104.78,72.17 v104.78,89.95
  Bottom 0.406: v104.78,89.95 v71.12,89.95
A8_C  (via drill 0.6)
  Top 0.406: v125.73,10.89 125.73,17.25 124.46,18.52 v124.46,35.34 | v100.97,35.34 100.65,35.34 93.98,28.68 93.98,27.09 92.71,25.82 U4.9
  Bottom 0.406: 127,9.62 v125.73,10.89 | v124.46,35.34 v100.97,35.34
  Bottom 1.676: 127,9.62 127,1.37
A9  (via drill 0.6)
  Top 0.406: U$2.P$17 80.01,107.41 81.28,106.14 81.28,99.8 80.01,98.52 U$1.P$17 80.01,85.19 v80.64,84.55 | U4.12 92.71,28.68 99.06,35.03 99.06,72.49 100.01,73.44 100.01,78.2 99.06,79.16 99.06,82.02 v96.52,84.55
  Bottom 0.406: v96.52,84.55 v80.64,84.55
A9_C  (via drill 0.6)
  Top 0.406: 134.62,9.62 v134.62,29.63 | v92.39,29.63 91.44,28.68 91.44,27.09 90.17,25.82 U4.8
  Top 1.676: 134.62,9.62 134.62,1.37
  Bottom 0.406: v134.62,29.63 v92.39,29.63
A10  (via drill 0.6)
  Top 0.406: U$2.P$20 77.47,99.8 76.2,98.52 v76.2,88.05 76.2,85.19 77.47,83.92 U$1.P$20 | U4.13 90.17,28.68 93.98,32.48 93.98,55.66 96.52,58.2 96.52,74.39 93.98,76.94 93.98,82.65 91.44,85.19 v91.44,88.05
  Bottom 0.406: v91.44,88.05 v76.2,88.05
A10_C  (via drill 0.6)
  Top 0.406: v130.81,10.89 v130.81,32.48 | v92.71,32.48 88.9,28.68 88.9,27.09 87.63,25.82 U4.7
  Bottom 0.406: 132.08,9.62 v130.81,10.89 | v130.81,32.48 v92.71,32.48
  Bottom 1.676: 132.08,9.62 132.08,1.37
A11  (via drill 0.6)
  Top 0.406: U$2.P$19 77.47,107.41 78.74,106.14 78.74,99.8 77.47,98.52 U$1.P$19 77.47,85.19 78.74,83.92 v78.74,79.16 | U4.14 87.63,28.68 91.44,32.48 91.44,55.66 93.98,58.2 93.98,75.66 93.03,76.62 v93.03,79.16
  Bottom 0.406: v93.03,79.16 v78.74,79.16
A11_C  (via drill 0.6)
  Top 0.406: 132.08,9.62 v132.08,31.53 | v89.22,31.53 86.36,28.68 86.36,27.09 85.09,25.82 U4.6
  Top 1.676: 132.08,9.62 132.08,1.37
  Bottom 0.406: v132.08,31.53 v89.22,31.53
A12  (via drill 0.6)
  Top 0.406: U$2.P$23 72.39,107.41 73.66,106.14 73.66,99.8 72.39,98.52 U$1.P$23 72.39,85.19 73.66,83.92 v73.66,57.25 | U4.15 85.09,28.68 88.9,32.48 88.9,55.66 v90.49,57.25
  Bottom 0.406: v90.49,57.25 v73.66,57.25
A12_C  (via drill 0.6)
  Top 0.406: 127,9.62 127,17.25 v126.05,18.2 | v82.55,18.2 U4.5
  Top 1.676: 127,9.62 127,1.37
  Bottom 0.406: v126.05,18.2 v82.55,18.2
A13  (via drill 0.6)
  Top 0.406: U$2.P$26 69.85,99.8 68.58,98.52 68.58,85.19 69.85,83.92 U$1.P$26 v69.85,55.35 | U4.16 82.55,28.68 86.36,32.48 v86.36,55.35
  Bottom 0.406: v86.36,55.35 v69.85,55.35
A13_C  (via drill 0.6)
  Top 0.406: v123.19,10.89 123.19,15.98 v121.92,17.25 | v80.01,17.25 U4.4
  Bottom 0.406: 124.46,9.62 v123.19,10.89 | v121.92,17.25 v80.01,17.25
  Bottom 1.676: 124.46,9.62 124.46,1.37
A14  (via drill 0.6)
  Top 0.406: U$2.P$25 69.85,107.41 71.12,106.14 71.12,99.8 69.85,98.52 U$1.P$25 69.85,85.19 71.12,83.92 v71.12,77.57 v71.12,54.39 | U4.17 80.01,28.68 83.82,32.48 v83.82,54.39 | U9.14 v44.45,77.57
  Bottom 0.406: v83.82,54.39 v71.12,54.39 | v44.45,77.57 v71.12,77.57
A14_C  (via drill 0.6)
  Top 0.406: 124.46,9.62 124.46,15.98 121.92,18.52 v121.92,22.01 | v77.47,22.01 U4.3
  Top 1.676: 124.46,9.62 124.46,1.37
  Bottom 0.406: v121.92,22.01 102.55,22.01 101.6,21.05 99.06,21.05 98.11,22.01 v77.47,22.01
A15  (via drill 0.6)
  Top 0.406: U$2.P$18 80.01,99.8 78.74,98.52 78.74,85.19 80.01,83.92 v80.01,82.02 U$1.P$18 | U4.18 77.47,28.68 81.28,32.48 81.28,55.66 v81.92,56.3 83.82,58.2 v83.82,82.02 | v41.91,56.3 U9.2
  Bottom 0.406: v83.82,82.02 v80.01,82.02 | v81.92,56.3 v41.91,56.3
A15_C  (via drill 0.6)
  Top 0.406: v133.35,10.89 v133.35,30.58 | v76.2,30.58 76.2,27.09 74.93,25.82 U4.2
  Bottom 0.406: 134.62,9.62 v133.35,10.89 | v133.35,30.58 v76.2,30.58
  Bottom 1.676: 134.62,9.62 134.62,1.37
CLK  (via drill 0.6)
  Top 0.406: U$2.P$42 49.53,99.8 48.26,98.52 48.26,85.19 49.53,83.92 v49.53,82.02 U$1.P$42 | U1.18 110.49,38.84 111.76,40.11 111.76,58.84 110.49,60.11 v110.49,61.06 | v37.47,60.74 v37.47,82.02
  Bottom 0.406: v110.49,61.06 37.78,61.06 v37.47,60.74 | v37.47,82.02 v49.53,82.02
CLK_C  (via drill 0.6)
  Top 0.406: v107.95,23.91 U1.2 | v104.14,11.21 v104.14,23.91
  Bottom 0.406: v104.14,23.91 v107.95,23.91 | 104.14,9.62 v104.14,11.21
  Bottom 1.676: 104.14,9.62 104.14,1.37
D0  (via drill 0.6)
  Top 0.406: U$2.P$34 59.69,99.8 58.42,98.52 v58.42,89.32 58.42,85.19 59.69,83.92 U$1.P$34 | U7.18 44.45,30.26 41.91,32.8 U8.2 41.91,46.77 43.18,48.04 v43.18,89.32
  Bottom 0.406: v43.18,89.32 v58.42,89.32
D0_C  (via drill 0.6)
  Top 0.406: v113.03,10.89 v113.03,15.34 | v41.91,15.34 U7.2
  Bottom 0.406: 114.3,9.62 v113.03,10.89 | v113.03,15.34 v41.91,15.34
  Bottom 1.676: 114.3,9.62 114.3,1.37
D1  (via drill 0.6)
  Top 0.406: U$1.P$33 v59.69,88.36 59.69,98.52 60.96,99.8 60.96,106.14 59.69,107.41 U$2.P$33 | U7.17 46.99,30.26 44.45,32.8 U8.3 44.45,46.77 45.72,48.04 v45.72,88.36
  Bottom 0.406: v45.72,88.36 v59.69,88.36
D1_C  (via drill 0.6)
  Top 0.406: 114.3,9.62 114.3,15.98 111.76,18.52 v111.76,25.82 | v44.45,25.82 U7.3
  Top 1.676: 114.3,9.62 114.3,1.37
  Bottom 0.406: v111.76,25.82 v44.45,25.82
D2  (via drill 0.6)
  Top 0.406: U$2.P$36 57.15,99.8 55.88,98.52 55.88,85.19 57.15,83.92 U$1.P$36 v57.15,76.62 | U7.16 49.53,30.26 46.99,32.8 U8.4 46.99,46.77 48.26,48.04 v48.26,50.27 | v59.69,50.9 v59.69,76.62
  Bottom 0.406: v48.26,50.27 59.05,50.27 v59.69,50.9 | v59.69,76.62 v57.15,76.62
D2_C  (via drill 0.6)
  Top 0.406: v110.49,10.89 v110.49,14.39 | v46.99,14.39 U7.4
  Bottom 0.406: 111.76,9.62 v110.49,10.89 | v110.49,14.39 v46.99,14.39
  Bottom 1.676: 111.76,9.62 111.76,1.37
D3  (via drill 0.6)
  Top 0.406: U$2.P$35 57.15,107.41 58.42,106.14 58.42,99.8 57.15,98.52 U$1.P$35 57.15,85.19 58.42,83.92 v58.42,45.5 | U7.15 52.07,30.26 49.53,32.8 U8.5 v49.53,44.55
  Bottom 0.406: v49.53,44.55 50.48,44.55 51.44,45.5 v58.42,45.5
D3_C  (via drill 0.6)
  Top 0.406: 111.76,9.62 111.76,15.98 109.22,18.52 v109.22,24.86 | v49.53,24.86 U7.5
  Top 1.676: 111.76,9.62 111.76,1.37
  Bottom 0.406: v109.22,24.86 v49.53,24.86
D4  (via drill 0.6)
  Top 0.406: U$2.P$38 54.61,99.8 53.34,98.52 53.34,85.19 54.61,83.92 U$1.P$38 v54.61,75.66 | U7.14 54.61,30.26 52.07,32.8 U8.6 v52.07,44.55 | v60.96,44.55 v60.96,75.66
  Bottom 0.406: v52.07,44.55 v60.96,44.55 | v60.96,75.66 v54.61,75.66
D4_C  (via drill 0.6)
  Top 0.406: v52.07,13.43 U7.6
  Bottom 0.406: 109.22,9.62 109.22,11.53 107.95,12.8 55.56,12.8 55.24,12.48 54.29,12.48 53.34,13.43 v52.07,13.43
  Bottom 1.676: 109.22,9.62 109.22,1.37
D5
  Top 0.406: U$2.P$37 54.61,107.41 55.88,106.14 55.88,99.8 54.61,98.52 U$1.P$37 54.61,85.19 55.88,83.92 55.88,47.73 54.61,46.46 U8.7 54.61,32.8 57.15,30.26 U7.13
D5_C  (via drill 0.6)
  Top 0.406: 109.22,9.62 v109.22,13.43 | v54.61,13.43 U7.7
  Top 1.676: 109.22,9.62 109.22,1.37
  Bottom 0.406: v109.22,13.43 v54.61,13.43
D6  (via drill 0.6)
  Top 0.406: U$2.P$40 52.07,99.8 50.8,98.52 50.8,85.19 52.07,83.92 U$1.P$40 52.07,73.12 50.8,71.85 v50.8,43.6 | U7.12 59.69,30.26 57.15,32.8 U8.8 v57.15,43.6
  Bottom 0.406: v57.15,43.6 v50.8,43.6
D6_C  (via drill 0.6)
  Top 0.406: v57.15,11.85 U7.8
  Bottom 0.406: 106.68,9.62 106.68,11.21 105.73,12.16 57.47,12.16 v57.15,11.85
  Bottom 1.676: 106.68,9.62 106.68,1.37
D7  (via drill 0.6)
  Top 0.406: U$2.P$39 52.07,107.41 53.34,106.14 53.34,99.8 52.07,98.52 U$1.P$39 52.07,85.19 53.34,83.92 v53.34,42.65 | U7.11 62.23,30.26 59.69,32.8 U8.9
  Bottom 0.406: U8.9 58.42,42.65 v53.34,42.65
D7_C  (via drill 0.6)
  Top 0.406: 106.68,9.62 v106.68,22.96 | v59.69,23.91 U7.9
  Top 1.676: 106.68,9.62 106.68,1.37
  Bottom 0.406: v106.68,22.96 103.5,22.96 102.55,23.91 v59.69,23.91
GND  (via drill 0.6, 0.7, 1.2)
  Top 0.406: U$1.P$41 49.53,98.52 50.8,99.8 50.8,106.14 49.53,107.41 U$2.P$41 | U$1.P$43 46.99,98.52 48.26,99.8 48.26,106.14 46.99,107.41 U$2.P$43
  Bottom 0.305: 154.94,9.62 154.94,11.21 153.99,12.16
  Bottom 1.676: 101.6,1.37 101.6,9.62 99.06,9.62 | 99.06,9.62 96.52,9.62 96.52,1.37 | 99.06,9.62 99.06,1.37 | 157.48,1.37 157.48,9.62 154.94,9.62 | 154.94,9.62 152.4,9.62 152.4,1.37 | 154.94,9.62 154.94,1.37
  other vias: 113.03,54.08 107.63,54.39 126.05,55.66 100.97,53.76 96.84,53.12 97.47,39.79 100.97,39.79 105.41,40.11 41.91,29.95 62.23,35.66 66.67,35.66 66.36,18.52 133.35,55.66 144.15,59.47 132.72,49 128.59,18.52 128.91,13.43 48.9,76.3 67.31,62.97 36.51,40.74 29.53,58.52 91.44,11.21 83.19,11.21 74.93,11.21 66.99,11.21 59.05,11.21 156.21,57.25 156.21,45.19 156.21,21.05 14.92,25.18 15.24,94.71 31.43,94.71 32.7,83.92 5.08,106.46 35.88,112.18 8.89,61.06 9.53,48.04 8.89,15.98 8.89,11.21 36.51,17.88 36.51,10.26 32.07,16.61 97.79,10.89 44.13,12.48 97.79,19.79 145.73,77.57 153.03,77.57 158.12,74.39 140.34,49 144.15,49 147.32,43.28 150.81,43.28 142.88,33.76 151.13,28.04
  pour Bottom (isolate 0.254): 102.23,9.62 0.64,9.62 0.64,116.62 159.38,116.62 159.38,9.94 152.08,9.94 152.08,11.21 102.23,11.21
  pour Top (isolate 0.254): 96.2,9.62 0.64,9.62 0.64,116.62 159.38,116.62 159.38,9.94 152.08,9.94 152.08,11.21 96.2,11.21
N$1  (via drill 0.6)
  Top 0.406: U$2.P$49 39.37,107.41 40.64,106.14 40.64,99.8 39.37,98.52 v39.37,89.63 | v20.32,89.63 20.32,39.79 R2.1
  Bottom 0.406: v39.37,89.63 v20.32,89.63
N$2  (via drill 0.6)
  Top 0.406: U$1.P$49 39.37,85.19 40.64,83.92 v40.64,75.98 | v27.94,75.98 v27.94,41.06
  Bottom 0.406: v40.64,75.98 v27.94,75.98 | v27.94,41.06 R1.1
N$3  (via drill 0.6)
  Top 0.406: U8.19 v41.91,53.12 | v52.07,53.44 U9.6
  Bottom 0.406: v41.91,53.12 51.75,53.12 v52.07,53.44
N$4
  Top 0.406: R16.2 R15.2 R1.2 R2.2 31.05,36.68 C13.+
N$5  (via drill 0.6)
  Top 0.406: U8.18 v44.45,57.89 | v32.7,57.89 v32.7,69 | v54.61,69 U9.10
  Bottom 0.406: v44.45,57.89 v32.7,57.89 | v32.7,69 v54.61,69
N$6
  Top 0.406: U8.17 46.99,50.58 49.53,53.12 U9.5
N$7  (via drill 0.6)
  Top 0.406: U8.16 v49.53,51.22 | v40.64,52.49 v40.64,64.23 | v52.07,64.87 U9.11
  Bottom 0.406: v40.64,64.23 51.44,64.23 v52.07,64.87 | v49.53,51.22 41.91,51.22 v40.64,52.49
N$8  (via drill 0.6)
  Top 0.406: U8.15 v52.07,52.17 | v46.99,52.17 U9.4
  Bottom 0.406: v52.07,52.17 v46.99,52.17
N$9  (via drill 0.6)
  Top 0.406: U8.14 v54.61,58.2 | v48.26,58.2 48.26,63.92 49.53,65.19 U9.12
  Bottom 0.406: v54.61,58.2 v48.26,58.2
N$10  (via drill 0.6)
  Top 0.406: U8.13 v57.15,59.16 | v44.45,59.16 U9.3
  Bottom 0.406: v57.15,59.16 v44.45,59.16
N$11  (via drill 0.6)
  Top 0.406: v36.2,47.73 v36.2,72.17 | v46.99,72.17 U9.13
  Bottom 0.406: U8.12 59.69,48.04 59.37,47.73 v36.2,47.73 | v36.2,72.17 v46.99,72.17
N$12
  Bottom 0.406: U10.2 17.78,64.23 25.4,64.23 U10.6
N$13
  Top 0.406: U9.15 41.91,69.31 39.37,66.77 U9.1
  Bottom 0.406: U10.3 U10.4 22.86,61.7 38.1,61.7 U9.1
N$14
  Bottom 0.406: U10.13 U10.12 20.32,69.31 27.94,69.31 U10.8
N$15
  Top 0.406: 11.43,11.53 40.32,11.53 40.32,14.7 11.43,14.7 11.43,11.53
N$16
  Bottom 0.254: 26.04,114.4 20.32,114.4 20.32,111.22 26.04,111.22 26.04,114.4
N$17
  Top 0.406: 34.29,103.92 14.92,103.92 14.92,107.73 34.29,107.73 34.29,103.92
N$18  (via drill 1.1)
  Top 1.676: D1.P$2 140.3,81.98 137.79,79.47 137.79,39.47 v140.65,36.61
  Bottom 1.676: v140.65,36.61 S1.1
N$19
  Top 0.254: 140.02,57.25 145.73,57.25 145.73,54.08 140.02,54.08 140.02,57.25
N$20
  Top 0.61: U11.1 U11.8 9.53,29.31 R12.2
  Bottom 0.61: U11.7 U11.8
N$21  (via drill 0.6)
  Top 0.406: JP2.4 7.54,46.86 9.21,45.19 v9.21,39.47
  Bottom 0.406: v9.21,39.47 12.7,39.47 18.1,44.87 R15.1
N$22  (via drill 0.7)
  Top 0.61: v13.34,17.25 13.34,21.37 17.14,25.18 U11.5 17.14,31.53 14.61,34.07 R13.2
  Bottom 0.61: R14.1 v13.34,17.25
N$23
  Bottom 1.676: JP1.PWR 150.13,80.7 149.22,79.79 142.56,79.79 140.34,82.02 136.8,82.02 D1.P$1
N$24
  Top 1.676: JP1.GND 156.13,82.44 JP1.GNDBREAK
  Bottom 1.676: JP1.GNDBREAK 147.23,85.44 D1.P$3
N$25  (via drill 0.7)
  Top 0.61: R14.2 28.57,18.52 C14.- 27.3,26.45 C15.2 | D3.A 17.46,38.2 14.61,41.06 v14.61,46.46 | v5.08,46.46 L3.2
  Bottom 0.61: U11.4 27.3,19.79 R14.2 | D3.A 18.73,35.66 20,34.39 26.04,34.39 27.3,33.12 C15.2 | v14.61,46.46 v5.08,46.46
N$26
  Top 0.61: U11.3 14.61,20.1 19.68,25.18 19.68,30.26 C15.1
N$27  (via drill 0.7)
  Top 0.61: U11.2 12.06,24.55 13.34,25.82 13.34,39.79 11.75,41.38 11.75,43.56 L2.2 11.71,48.32 v11.75,48.36
  Bottom 0.61: v11.75,48.36 D3.C
N$28  (via drill 0.6)
  Top 0.406: JP2.1 7.49,98.71 7.94,99.16 8.89,99.16 11.75,96.3 11.75,93.44 10.48,92.17 v10.48,50.27
  Bottom 0.406: v10.48,50.27 14.92,50.27 16.19,51.54 20,51.54 R16.1
N$29  (via drill 0.6)
  Top 1.27: U12.2 129.74,88.8 v129.86,88.68 | v149.22,88.68 L1.1 | D2.C v139.7,92.17
  Bottom 1.27: v129.86,88.68 v149.22,88.68 | v139.7,92.17 L1.1
SLOTA  (via drill 0.6)
  Top 0.406: U6.19 v85.09,67.73 | v54.61,67.73 U9.7
  Bottom 0.406: v85.09,67.73 v54.61,67.73
SLOTB  (via drill 0.6)
  Top 0.406: U6.18 v87.63,72.17 | v57.15,72.49 U9.9
  Bottom 0.406: v87.63,72.17 57.47,72.17 v57.15,72.49
SNDIN  (via drill 0.6)
  Top 0.406: 96.52,9.62 95.89,10.26 v94.93,10.26 | v31.75,19.79 31.75,29.63 33.02,30.9 33.02,32.74 C13.-
  Top 1.676: 96.52,1.37 96.52,9.62
  Bottom 0.406: v94.93,10.26 94.3,9.62 41.91,9.62 v31.75,19.79
VCC  (via drill 0.6, 1.1, 1.2)
  Top 0.406: R3.1 R4.1 R5.1 | R8.2 R7.2 R6.2 | R11.2 R10.2 R9.2 156.21,70.58 155.89,70.27 | v36.2,88.05 v36.2,78.84 v36.2,73.44 34.29,71.54 C11.1 | v39.37,73.44 U9.16 | v31.11,69.95 31.11,52.17 C10.1 | U8.20 38.1,47.73 v38.1,38.84 38.1,28.68 U7.20 | U4.20 v72.39,38.84 71.12,40.11 71.12,47.73 U5.20 | U6.24 v72.39,78.84 | U3.14 v110.49,77.25 | 107.63,49 U2.14
  Top 0.61: U11.6 R12.1
  Top 0.813: U$2.P$47 41.91,107.41 43.18,106.14 43.18,99.8 41.91,98.52 v41.91,88.05 U$1.P$47 | U$2.P$45 44.45,107.41 45.72,106.14 45.72,99.8 44.45,98.52 U$1.P$45
  Top 1.27: U12.4 133.15,88.61 | 133.15,88.61 v133.15,77.25 133.15,76.19 v135.89,73.44 | v147.32,73.44 R6.2 | U1.20 102.23,24.23 102.23,11.53 101.6,10.89 101.6,9.62 | 133.15,88.61 143.44,88.61 145.41,90.59 145.41,95.98 L1.2 151.13,101.7 v151.13,107.1 C2.+
  Top 1.676: 99.06,1.37 99.06,9.62 101.6,9.62 | 101.6,9.62 104.14,9.62 104.14,1.37 | 101.6,9.62 101.6,1.37 | 152.4,1.37 152.4,9.62 | 152.4,9.62 154.94,9.62 | 154.94,9.62 157.48,9.62 157.48,1.37 | 154.94,9.62 154.94,1.37 | v135.89,73.44 R5.1 | 152.4,9.62 152.4,10.26 151.45,11.21 151.45,23.28 157.8,29.63 157.8,39.79 151.45,46.14 v151.45,51.54 151.45,55.66 155.89,60.11 155.89,70.27 v155.89,73.44 | v107.63,51.54 107.63,49 107.63,34.07 105.41,31.85 U1.20
  Bottom 0.406: v36.2,73.44 v39.37,73.44 | C11.1 31.75,70.58 v31.11,69.95 29.53,68.36 16.19,68.36 U10.14 C12.1 | U8.20 C10.1 | C9.1 U7.20 | C6.1 U4.20 | U5.20 C7.1 | U6.24 C8.1 | v72.39,78.84 v36.2,78.84 | U3.14 C5.1 | v110.49,77.25 v133.15,77.25 | U2.14 C4.1 | C3.1 U1.20 | v72.39,38.84 v38.1,38.84 | v41.91,88.05 v36.2,88.05
  Bottom 0.61: C17.1 6.03,25.82 13.02,25.82 U11.6 | R12.1 19.05,31.85 20.95,29.95 31.75,29.95 C9.1
  Bottom 1.016: 155.26,49 155.28,49 X1.1
  Bottom 1.27: v151.13,107.1 117.79,107.1 112.71,112.18 47.94,112.18 U$2.P$45 U$2.P$47
  Bottom 1.676: v155.89,73.44 v147.32,73.44 v135.89,73.44 | v107.63,51.54 v151.45,51.54 151.45,49 152.08,48.36 154.62,48.36 155.26,49

### Text on the board
Top: Version 1.0 | R-D | RetroDepot.net RD-10
Bottom: R-D
tPlace: AUD-IN | +12V / GND / GND / +5V | PWR | 560 Ohm Resistors
bPlace: +12V / GND / GND / +5V